# EAGLE design ant_esc_schematic (EAGLE 6.3)
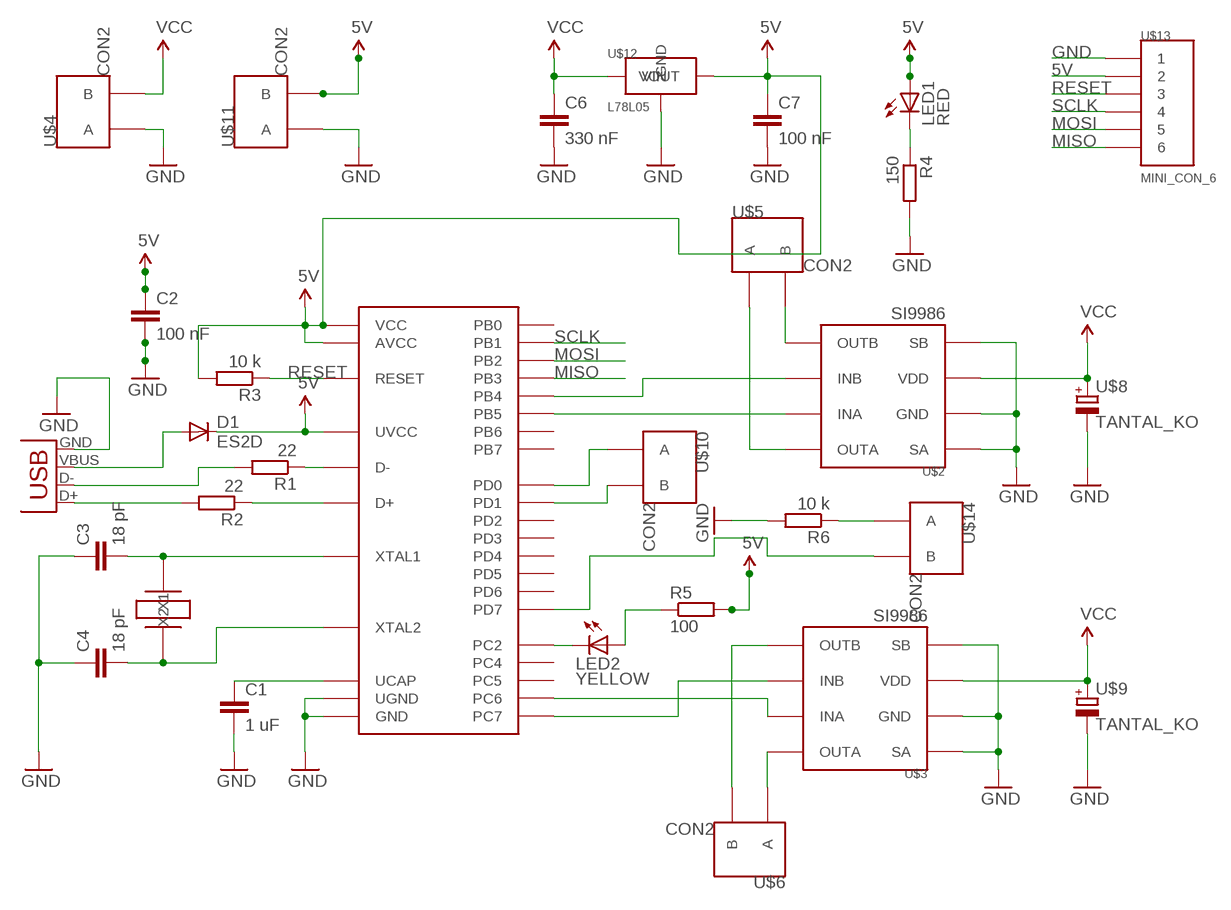
[diagram p0: schematic, sheet 1]

## Parts
C1  1 uF  C-EUC0805  [C0805]
C2  100 nF  C-EUC0805  [C0805]
C3  18 pF  C-EUC0805  [C0805]
C4  18 pF  C-EUC0805  [C0805]
C6  330 nF  C-EUC0805  [C0805]
C7  100 nF  C-EUC0805  [C0805]
D1  ES2D  [SMB]
JP1  USBSMD  [USB-MINIB]
LED1  RED  LEDCHIPLED_0805  [CHIPLED_0805]
LED2  YELLOW  LEDCHIPLED_0805  [CHIPLED_0805]
R1  22  R-EU_M0805  [M0805]
R2  22  R-EU_M0805  [M0805]
R3  10 k  R-EU_M0805  [M0805]
R4  150  R-EU_M0805  [M0805]
R5  100  R-EU_M0805  [M0805]
R6  10 k  R-EU_M0805  [M0805]
U$1  ATMEGA8U2  [TQFP32-08]
U$2  SI9986  [SOIC8]
U$3  SI9986  [SOIC8]
U$4  CON2  [332-02]
U$5  CON2  [332-02]
U$6  CON2  [332-02]
U$7  16 MHz  XTAL_16MHZ_ABM3  [ABM3]
U$8  TANTAL_KO  [KEMET_C]
U$9  TANTAL_KO  [KEMET_C]
U$10  CON2  [332-02]
U$11  CON2  [332-02]
U$12  L78L05  [SOT89]
U$13  MINI_CON_6  [MIN_CON_6]
U$14  CON2  [332-02]

## Nets
5V: C2.1 C7.1 D1.C LED1.A R3.2 R5.2 U$1.AVCC U$1.UVCC U$1.VCC U$11.2(B) U$12.VOUT U$13.2
GND: C1.2 C2.2 C3.1 C4.1 C6.2 C7.2 JP1.GND R4.2 R6.2 U$1.GND U$1.UGND U$2.GND U$2.SA U$2.SB U$3.GND U$3.SA U$3.SB U$4.1(A) U$8.CATHODE-(-) U$9.CATHODE-(-) U$11.1(A) U$12.2@1(GND) U$12.GND U$13.1
MISO: U$1.PB3 U$13.6
MOSI: U$1.PB2 U$13.5
N$1: R1.1 U$1.D-
N$2: R2.1 U$1.D+
N$3: JP1.D+ R2.2
N$4: D1.A JP1.VBUS
N$5: JP1.D- R1.2
N$6: C1.1 U$1.UCAP
N$7: U$1.PD0 U$10.1(A)
N$8: U$1.PB5 U$2.INA
N$9: U$1.PB4 U$2.INB
N$10: U$1.PC6 U$3.INA
N$11: U$1.PC7 U$3.INB
N$12: U$3.OUTA U$6.1(A)
N$13: U$3.OUTB U$6.2(B)
N$14: U$2.OUTB U$5.2(B)
N$15: U$2.OUTA U$5.1(A)
N$16: LED1.C R4.1
N$17: LED2.C U$1.PC2
N$18: C4.2 U$1.XTAL2 U$7.X1
N$19: C3.2 U$1.XTAL1 U$7.X2
N$20: U$1.PD1 U$10.2(B)
N$21: U$1.PD7 U$14.2(B)
N$22: LED2.A R5.1
N$24: R6.1 U$14.1(A)
RESET: R3.1 U$1.RESET U$13.3
SCLK: U$1.PB1 U$13.4
VCC: C6.1 U$2.VDD U$3.VDD U$4.2(B) U$8.ANODE+(+) U$9.ANODE+(+) U$12.VIN
Unconnected: U$1.PB0 U$1.PB6 U$1.PB7 U$1.PC4 U$1.PC5 U$1.PD2 U$1.PD3 U$1.PD4 U$1.PD5 U$1.PD6

## Library data of the parts
C1-C4 C6 C7 = resistor:C-EU: CAPACITOR, European symbol
D1 = diode:ES2D: DIODE super fast rectifier, 2 A
JP1 = SparkFun-Connectors:USB: USB Connectors USB-B-PTH is fully proven SKU : PRT-00139/CONN-08278 USB-miniB is fully proven SKU : PRT-00587 USB-A-PCB is untested. USB-A-H is throughly reviewed, but untested. Spark Fun Electronics SKU : PRT-00437 USB-B-SMT is throughly reviewed, but untested. Needs silkscreen touching up. USB-A-S has not been used/tested USB-MB-H has not been used/tested USB-MICROB has been used. CONN-09505
LED1 LED2 = led:LED: LED OSRAM: - CHIPLED LG R971, LG N971, LY N971, LG Q971, LY Q971, LO R971, LY R971 LH N974, LH R974 LS Q976, LO Q976, LY Q976 LO Q996 - Hyper CHIPLED LW Q18S LB Q993, LB Q99A, LB R99A - SideLED LS A670, LO A670, LY A670, LG A670, LP A670 LB A673, LV A673, LT A673, LW A673 LH A674 LY A675 LS A676, LA A676, LO A676, LY A676, LW A676 LS A679, LY A679, LG A679 - Hyper Micro SIDELED® LS Y876, LA Y876, LO Y876, LY Y876 LT Y87S - SmartLED LW L88C, LW L88S LB L89C, LB L89S, LG L890 LS L89K, LO L89K, LY L89K LS L896, LA L896, LO L896, LY L896 - TOPLED LS T670, LO T670, LY T670, LG T670, LP T670 LSG T670, LSP T670, LSY T670, LOP T670, LYG T670 LG T671, LOG T671, LSG T671 LB T673, LV T673, LT T673, LW T673 LH T674 LS T676, LA T676, LO T676, LY T676, LB T676, LH T676, LSB T676, LW T676 LB T67C, LV T67C, LT T67C, LS T67K, LO T67K, LY T67K, LW E67C LS E67B, LA E67B, LO E67B, LY E67B, LB E67C, LV E67C, LT E67C LW T67C LS T679, LY T679, LG T679 LS T770, LO T770, LY T770, LG T770, LP T770 LB T773, LV T773, LT T773, LW T773 LH T774 LS E675, LA E675, LY E675, LS T675 LS T776, LA T776, LO T776, LY T776, LB T776 LHGB T686 LT T68C, LB T68C - Hyper Mini TOPLED® LB M676 - Mini TOPLED Santana® LG M470 LS M47K, LO M47K, LY M47K Source: http://www.osram.convergy.de LUXEON: - LUMILED® LXK2-PW12-R00, LXK2-PW12-S00, LXK2-PW14-U00, LXK2-PW14-V00 LXK2-PM12-R00, LXK2-PM12-S00, LXK2-PM14-U00 LXK2-PE12-Q00, LXK2-PE12-R00, LXK2-PE12-S00, LXK2-PE14-T00, LXK2-PE14-U00 LXK2-PB12-K00, LXK2-PB12-L00, LXK2-PB12-M00, LXK2-PB14-N00, LXK2-PB14-P00, LXK2-PB14-Q00 LXK2-PR12-L00, LXK2-PR12-M00, LXK2-PR14-Q00, LXK2-PR14-R00 LXK2-PD12-Q00, LXK2-PD12-R00, LXK2-PD12-S00 LXK2-PH12-R00, LXK2-PH12-S00 LXK2-PL12-P00, LXK2-PL12-Q00, LXK2-PL12-R00 Source: www.luxeon.com KINGBRIGHT: KA-3528ASYC Source: www.kingbright.com
R1-R6 = resistor:R-EU_: RESISTOR, European symbol
U$1 = lxrobotics:ATMEGA8U2
U$2 U$3 = lxrobotics:SI9986
U$4-U$6 U$10 U$11 U$14 = lxrobotics:CON2
U$7 = lxrobotics:XTAL_16MHZ_ABM3
U$8 U$9 = lxrobotics:TANTAL_KO
U$12 = lxrobotics:L78L05
U$13 = lxrobotics:MINI_CON_6

## Board
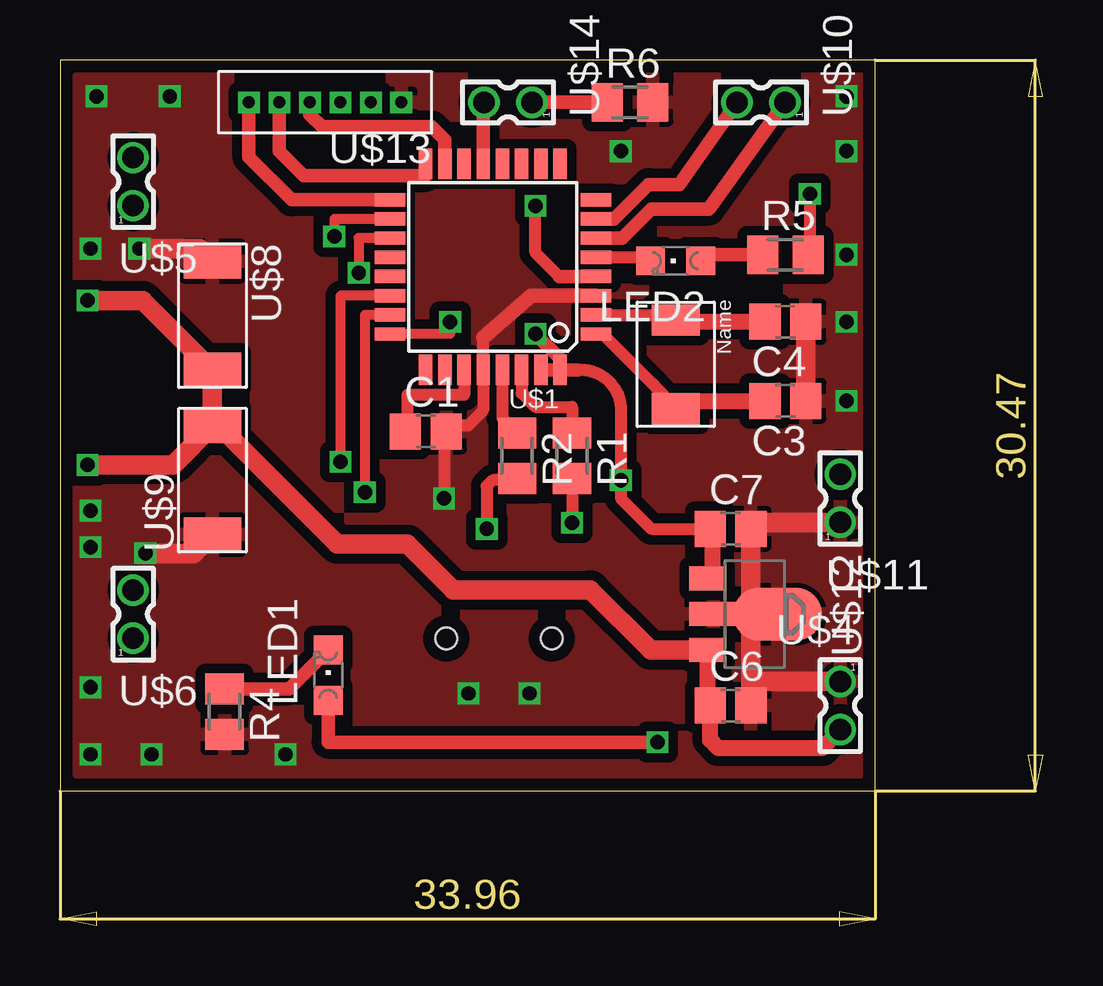
[diagram p1: board, top side]
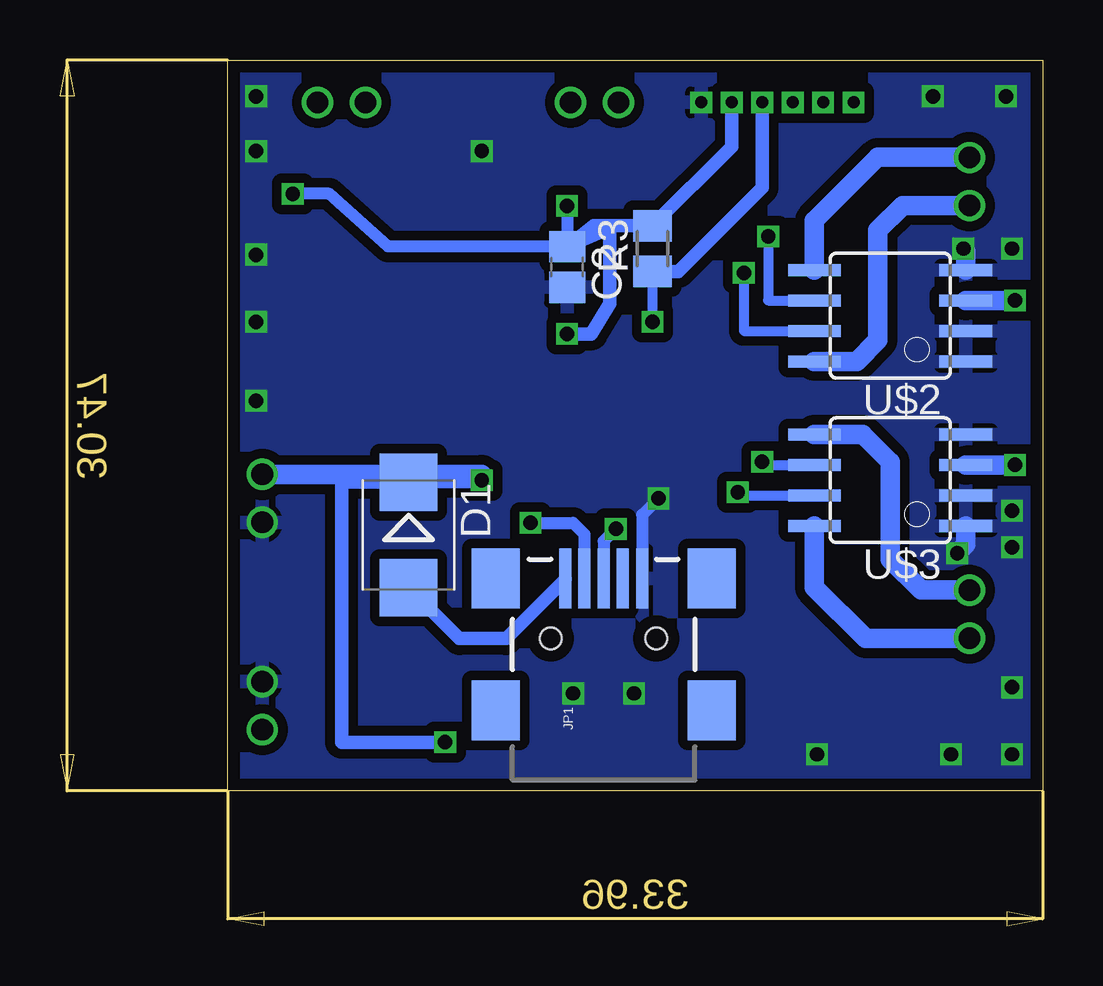
[diagram p2: board, bottom side, seen from below]

Size 33.96 x 30.47 mm. Coordinates in mm from the lower left corner, seen from the top.
Outline: 0,0 33.96,0 33.96,30.47 0,30.47 0,0
Copper layers (1*16): Top 0.035mm / dielectric 1.5mm / Bottom 0.035mm
Design rules "leiton": minimum track width 6mil, minimum drill 0.3mm, track to track 6mil, track to pad 6mil, pad to pad 6mil, via to via 6mil, smd to smd 6mil, copper to edge 20mil, drill to drill 8mil, minimum pad ring 8mil, minimum via ring 6mil, stop-mask expansion 3mil, vias tented up to drill 0mil, thermal gap 8mil

### Footprints (pad centres in the part's own frame; a part is rotated, then mirrored left to right if it is on the bottom)
C0805 = smd 1.3 x 1.5: 1 -0.85,0; 2 0.85,0
SMB = smd 2.4 x 2.4: A 2.2,0; C -2.2,0
USB-MINIB = smd 2.5 x 0.5: D+ 2.5,0; D- 2.5,0.8; GND 2.5,-1.6; ID 2.5,-0.8; VBUS 2.5,1.6 | smd 2.5 x 2: MTN1 -3,4.5; MTN2 2.5,4.5; MTN3 -3,-4.5; MTN4 2.5,-4.5 | hole 0.9: 0,2.2; 0,-2.2
CHIPLED_0805 = smd 1.2 x 1.2: A 0,-1.05; C 0,1.05
M0805 = smd 1.3 x 1.6: 1 -0.95,0; 2 0.95,0
TQFP32-08 = smd 0.559 x 1.27: AVCC -2.8,4.293; D+ -0.4,4.293; D- -1.2,4.293; PB0 1.2,-4.293; PB1 2,-4.293; PB2 2.8,-4.293; PC4 2,4.293; PC5 2.8,4.293; PD3 -2.8,-4.293; PD4 -2,-4.293; PD5 -1.2,-4.293; PD6 -0.4,-4.293; PD7 0.4,-4.293; UCAP 1.2,4.293; UGND 0.4,4.293; UVCC -2,4.293 | smd 1.27 x 0.559: GND -4.293,1.2; PB3 4.293,-2.8; PB4 4.293,-2; PB5 4.293,-1.2; PB6 4.293,-0.4; PB7 4.293,0.4; PC2 -4.293,-0.4; PC6 4.293,2; PC7 4.293,1.2; PD0 -4.293,-1.2; PD1 -4.293,-2; PD2 -4.293,-2.8; RESET 4.293,2.8; VCC -4.293,0.4; XTAL1 -4.293,2.8; XTAL2 -4.293,2
SOIC8 = smd 0.5 x 2.2: GND -0.645,-3.154; INA -0.635,3.154; INB 0.635,3.154; OUTA -1.905,3.154; OUTB 1.905,3.154; SA -1.905,-3.154; SB 1.895,-3.154; VDD 0.625,-3.154
332-02 = drill 0.9 pad 1.27: 1 0,-1; 2 0,1
ABM3 = smd 1.3 x 2: X1 -1.85,0; X2 1.85,0
KEMET_C = smd 1.45 x 2.4: ANODE+ 2.275,0; CATHODE- -2.275,0
SOT89 = smd 2.2 x 3.7: 2@1 0,0.94 | smd 1 x 2: GND 0,-1.727 | smd 1 x 1.5: VIN 1.499,-1.981; VOUT -1.499,-1.981
MIN_CON_6 = drill 0.5 square: 1 -3.81,0; 2 -2.54,0; 3 -1.27,0; 4 0,0; 5 1.27,0; 6 2.54,0

### Placement (x,y rotation side)
C1  15.24,14.99 0 top
C2  19.81,21.84 270 bottom
C3  30.23,16.26 180 top
C4  30.23,19.56 180 top
C6  27.94,3.56 0 top
C7  27.94,10.92 0 top
D1  26.42,10.67 270 bottom
JP1  18.29,6.35 90 bottom
LED1  11.18,4.83 0 top
LED2  25.65,22.1 90 top
R1  21.34,13.97 270 top
R2  19.05,13.97 270 top
R3  16.26,22.61 90 bottom
R4  6.86,3.3 270 top
R5  30.23,22.35 0 top
R6  23.75,28.7 0 top
U$1  18.03,21.84 180 top
U$2  6.35,19.81 90 bottom
U$3  6.35,12.95 90 bottom
U$4  32.51,3.56 180 top
U$5  3.05,25.4 0 top
U$6  3.05,7.37 0 top
U$7  25.65,17.78 270 top
U$8  6.35,19.81 270 top
U$9  6.35,12.95 90 top
U$10  29.21,28.7 90 top
U$11  32.51,12.19 0 top
U$12  28.96,7.37 270 top
U$13  10.41,28.7 180 top
U$14  18.67,28.7 90 top

### Tracks (layer width: path | path; a pad name or v marks a point on that pad's centre or on a via)
5V  (via drill 0.6)
  Top 0.508: 21.56,17.55 arc-90 23.37,16 v23.37,12.95 23.37,12.19 24.64,10.92 C7.1 | v31.24,24.89 31.24,22.42 R5.2 | 20.81,21.44 19.81,22.44 v19.81,24.38
  Top 0.559: LED1.A 11.18,2.03 v24.89,2.03 | 21.56,17.55 U$1.AVCC | U$1.AVCC U$1.UVCC | 20.81,21.44 U$1.VCC | U$1.AVCC 20.83,18.03 v19.81,19.05
  Top 0.66: C7.1 27.09,10.76 27.18,10.67 27.18,9.07 U$12.VOUT
  Bottom 0.508: D1.C 23.54,12.87 v23.37,12.95 | v31.24,24.89 29.72,24.89 27.27,22.69 C2.1 v19.81,24.38
  Bottom 0.559: U$13.2 12.95,26.86 R3.2 | v24.89,2.03 29.21,2.03 29.21,12.87 D1.C | R3.2 16.44,23.56 16.51,23.62 | R3.2 18.7,23.56 C2.1 18.03,23.46 18.03,20.32 18.8,19.05 v19.81,19.05
  Bottom 0.66: D1.C 26.74,13.19
  Bottom 0.813: U$11.2 23.37,13.19 v23.37,12.95
GND  (via drill 0.6)
  Top 0.508: v16,12.19 16,14.9 C1.2 16.34,15.24 17.02,15.24 17.63,15.86 U$1.UGND 17.63,18.9
  Top 0.61: 17.63,18.9 19.63,20.64 U$1.GND | U$11.1 32.51,10.92
  Top 0.66: U$4.1 32.41,4.66 | 32.24,10.92 U$11.1
  Top 0.813: U$8.CATHODE- 5.83,22.61 v3.3,22.61 | U$9.CATHODE- 5.58,9.91 v3.56,9.91 | C6.2 28.79,4.57 | 28.79,4.57 C7.2 29.06,11.19 U$11.1 | 32.41,4.66 32.32,4.57 28.79,4.57 | C4.1 C3.1
  Bottom 0.508: v16,12.19 16.69,11.51 JP1.GND
  Bottom 0.813: v3.3,22.61 3.2,22.5 U$2.SB | v3.56,9.91 3.2,10.27 U$3.SA
  other vias: 1.27,1.52 3.81,1.52 9.4,1.52 1.27,4.32 1.27,10.16 1.27,11.68 1.27,22.61 1.52,28.96 4.57,28.96 23.37,26.67 32.77,28.96 32.77,26.67 32.77,22.35 32.77,19.56 32.77,16.26 17.02,4.06 19.56,4.06
  pour Bottom (isolate 0.406): 0.51,0.51 33.27,0.51 33.27,29.72 0.51,29.72
  pour Top (isolate 0.406): 0.76,29.72 33.27,29.72 33.27,0.76 0.76,0.76
MISO
  Top 0.559: U$1.PB3 9.65,24.64 7.87,26.42 U$13.6
MOSI
  Top 0.559: U$13.5 9.14,26.67 10.16,25.65 15.23,25.65 U$1.PB2
N$1
  Top 0.508: U$1.D- 19.23,16.58 19.81,16 21.34,16 R1.1
N$2
  Top 0.508: U$1.D+ 18.43,15.54 R2.1
N$3  (via drill 0.6)
  Top 0.508: R2.2 18.98,12.95 18.03,12.95 17.78,12.7 v17.78,10.92
  Bottom 0.508: v17.78,10.92 18.29,10.41 JP1.D+
N$4
  Bottom 0.508: JP1.VBUS 19.89,8.38
  Bottom 0.559: JP1.VBUS 19.89,8.81 22.35,6.35 24.3,6.35 D1.A
N$5  (via drill 0.6)
  Top 0.508: R1.2 v21.34,11.18
  Bottom 0.508: v21.34,11.18 19.56,11.18 19.09,10.71 JP1.D-
N$6
  Top 0.508: U$1.UCAP 16.83,16.51 14.48,16.51 14.48,14.99 C1.1
N$7
  Top 0.559: U$1.PD0 23.42,23.04 24.64,24.26 27.03,24.26 U$10.1
N$8  (via drill 0.6)
  Top 0.406: U$1.PB5 12.45,23.04 v12.45,21.59
  Bottom 0.406: v12.45,21.59 12.45,19.18 U$2.INA
N$9  (via drill 0.6)
  Top 0.406: U$1.PB4 11.43,23.84 v11.43,23.11
  Bottom 0.406: v11.43,23.11 11.43,20.45 U$2.INB
N$10  (via drill 0.6)
  Top 0.406: U$1.PC6 12.7,19.84 v12.7,12.45
  Bottom 0.406: v12.7,12.45 12.32,12.32 U$3.INA
N$11  (via drill 0.6)
  Top 0.406: U$1.PC7 11.68,20.64 v11.68,13.72
  Bottom 0.406: v11.68,13.72 11.56,13.59 U$3.INB
N$12
  Bottom 0.813: U$3.OUTA 9.5,8.49 7.37,6.35 3.06,6.35 U$6.1
N$13
  Bottom 0.813: U$6.2 5.06,8.37 6.35,9.65 6.35,13.72 7.49,14.86 U$3.OUTB
N$14
  Bottom 0.813: U$2.OUTB 9.5,23.77 6.86,26.42 3.06,26.42 U$5.2
N$15
  Bottom 0.813: U$5.1 5.83,24.4 6.86,23.37 6.86,18.8 7.75,17.91 U$2.OUTA
N$16
  Top 0.559: R4.1 9.55,4.25 LED1.C
N$17
  Top 0.508: U$1.PC2 24.46,22.24 LED2.C
N$18
  Top 0.508: U$1.XTAL2 25.44,19.84 arc-90 U$7.X1
  Top 0.66: 25.15,19.81 25.33,19.63 U$7.X1 25.73,19.56 C4.2
N$19
  Top 0.508: U$1.XTAL1 22.61,19.04 24.64,17.02 U$7.X2
  Top 0.66: 25.44,15.93 U$7.X2 25.98,16.26 C3.2
N$20
  Top 0.559: U$1.PD1 23.08,23.84 24.51,25.27 25.8,25.27 U$10.2
N$21
  Top 0.559: U$1.PD7 17.63,28.67 U$14.2
N$22
  Top 0.559: LED2.A 26.7,22.35 R5.1
N$24
  Top 0.559: U$14.1 R6.1
RESET  (via drill 0.6)
  Top 0.406: v16.26,19.56 16.26,19.04 U$1.RESET
  Bottom 0.406: R3.1 v16.26,19.56
  Bottom 0.559: R3.1 15.17,21.66 11.68,25.15 U$13.3
SCLK
  Top 0.559: U$13.4 10.41,28.19 10.92,27.69 15.49,27.69 16.03,27.15 U$1.PB1
VCC  (via drill 0.6)
  Top 0.66: U$12.VIN 26.98,3.67 C6.1 27.09,2.12 27.43,1.78 31.75,1.78 32.51,2.54 U$4.2
  Top 0.813: U$9.ANODE+ 4.71,13.59 v1.14,13.59 | v1.14,20.45 3.44,20.45 U$8.ANODE+ U$9.ANODE+ | U$9.ANODE+ 6.62,15.23 11.56,10.29 14.48,10.29 16.38,8.38 22.1,8.38 24.61,5.87 U$12.VIN
  Bottom 0.813: v1.14,13.59 1.15,13.58 U$3.VDD | v1.14,20.45 1.15,20.44 U$2.VDD